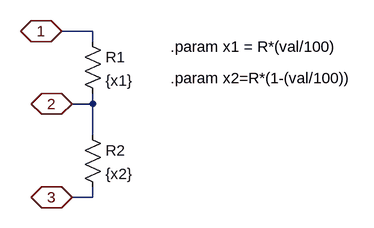
[diagram p0: schematic pot.asc]
pot.asc, the LTspice schematic file:
Version 4
SHEET 1 880 680
WIRE 176 32 128 32
WIRE 176 48 176 32
WIRE 176 144 176 128
WIRE 176 144 144 144
WIRE 176 192 176 144
WIRE 176 288 176 272
WIRE 176 288 144 288
FLAG 128 32 1
IOPIN 128 32 BiDir
FLAG 144 288 3
IOPIN 144 288 BiDir
FLAG 144 144 2
IOPIN 144 144 BiDir
SYMBOL res 160 32 R0
SYMATTR InstName R1
SYMATTR Value {x1}
SYMBOL res 160 176 R0
SYMATTR InstName R2
SYMATTR Value {x2}
TEXT 296 56 Left 2 !.param x1 = R*(val/100)
TEXT 296 104 Left 2 !.param x2=R*(1-(val/100))

The netlist it stands for:
* pot.asc
R1 1 2 {x1}
R2 2 3 {x2}
.param x1 = R*(val/100)
.param x2=R*(1-(val/100))
.backanno
.end